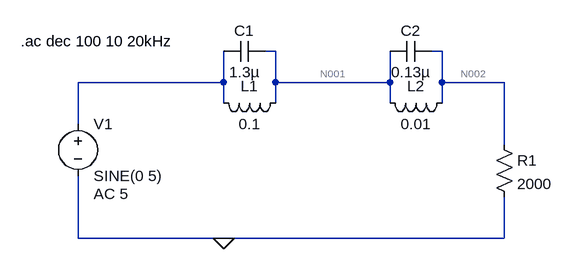
[diagram p0: schematic doublenotch.asc]
doublenotch.asc, the LTspice schematic file:
Version 4.1
SHEET 1 880 680
WIRE 288 16 272 16
WIRE 544 16 528 16
WIRE 208 64 208 16
WIRE 208 64 -16 64
WIRE 288 64 288 16
WIRE 464 64 464 16
WIRE 464 64 288 64
WIRE 544 64 544 16
WIRE 640 64 544 64
WIRE 208 96 208 64
WIRE 288 96 288 64
WIRE 464 96 464 64
WIRE 544 96 544 64
WIRE -16 128 -16 64
WIRE 640 160 640 64
WIRE -16 304 -16 208
WIRE 208 304 -16 304
WIRE 640 304 640 240
WIRE 640 304 208 304
FLAG 208 304 0
SYMBOL voltage -16 112 R0
WINDOW 123 24 124 Left 2
WINDOW 39 0 0 Left 0
SYMATTR Value2 AC 5
SYMATTR InstName V1
SYMATTR Value SINE(0 5)
SYMBOL cap 272 0 R90
WINDOW 0 0 32 VBottom 2
WINDOW 3 32 32 VTop 2
SYMATTR InstName C1
SYMATTR Value 1.3µ
SYMBOL cap 528 0 R90
WINDOW 0 0 32 VBottom 2
WINDOW 3 32 32 VTop 2
SYMATTR InstName C2
SYMATTR Value 0.13µ
SYMBOL ind 304 80 R90
WINDOW 0 5 56 VBottom 2
WINDOW 3 32 56 VTop 2
SYMATTR InstName L1
SYMATTR Value 0.1
SYMATTR SpiceLine Rser=1m
SYMBOL ind 560 80 R90
WINDOW 0 5 56 VBottom 2
WINDOW 3 32 56 VTop 2
SYMATTR InstName L2
SYMATTR Value 0.01
SYMATTR SpiceLine Rser=1m
SYMBOL res 624 144 R0
SYMATTR InstName R1
SYMATTR Value 2000
TEXT -104 0 Left 2 !.ac dec 100 10 20kHz

The netlist it stands for:
* doublenotch.asc
V1 N003 0 SINE(0 5) AC 5
C1 N001 N003 1.3µ
C2 N002 N001 0.13µ
L1 N001 N003 0.1 Rser=1m
L2 N002 N001 0.01 Rser=1m
R1 N002 0 2000
.ac dec 100 10 20kHz
.backanno
.end

* Results of the author's LTspice run, read from the files saved beside the schematic
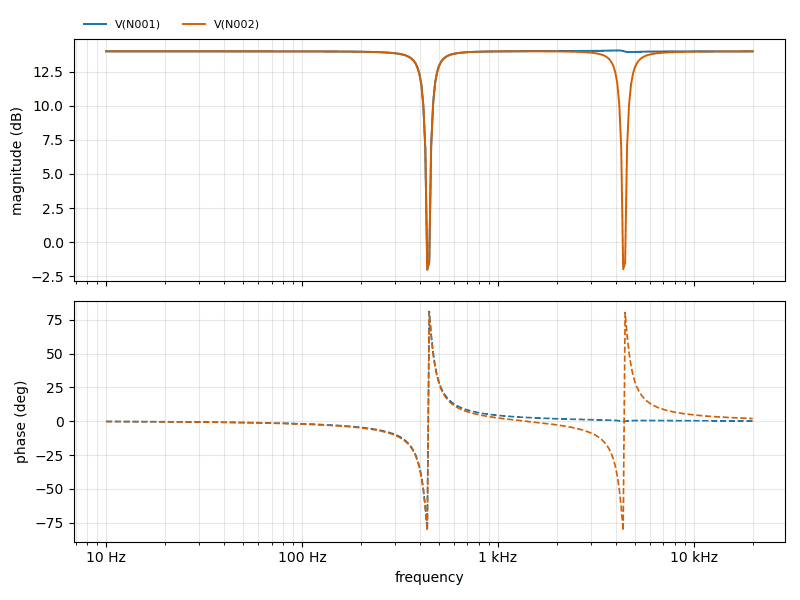
[diagram p1: AC Analysis of doublenotch.asc, plotted from the saved traces]
* AC Analysis, 1 run:
*   V(N001): 13.98 dB at 10 Hz, 13.98 dB at 20 kHz, peak 14.04 dB at 4.074 kHz, 3 dB below the peak at 474 Hz
*   V(N002): 13.98 dB at 10 Hz, 13.97 dB at 20 kHz, peak 13.98 dB at 1.38 kHz, 3 dB below the peak at 473.5 Hz and 4.115 kHz